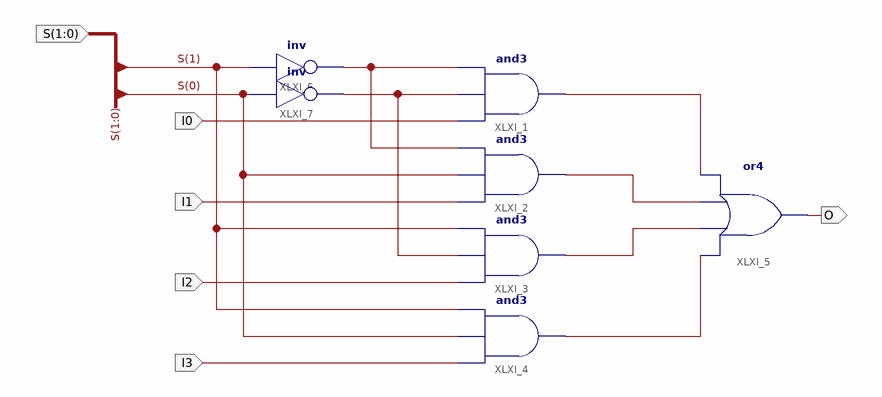
[diagram p0: schematic sheet 1]
// Xilinx ISE schematic MUX4_1.sch (virtex6) as structural Verilog: 7 symbols, 6 ports
module MUX4_1 (
  input  [1:0] S,
  input  I0,
  input  I1,
  input  I2,
  input  I3,
  output O
);

  wire XLXN_1, XLXN_2, XLXN_3, XLXN_4, XLXN_9, XLXN_12;

  and XLXI_1 (XLXN_2, I0, XLXN_12, XLXN_9);
  and XLXI_2 (XLXN_3, I1, S[0], XLXN_9);
  and XLXI_3 (XLXN_4, I2, XLXN_12, S[1]);
  and XLXI_4 (XLXN_1, I3, S[0], S[1]);
  or XLXI_5 (O, XLXN_1, XLXN_4, XLXN_3, XLXN_2);
  not XLXI_6 (XLXN_9, S[1]);
  not XLXI_7 (XLXN_12, S[0]);
endmodule
